# Altium schematic sheet xl6009_kian_v1_MULTY.SchDoc
size A; SheetNumber: 1; SheetTotal: 3
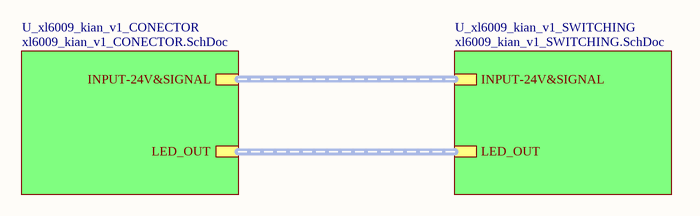
[diagram p0: xl6009_kian_v1_MULTY.SchDoc]

## Sub-sheets
U_xl6009_kian_v1_CONECTOR = xl6009_kian_v1_CONECTOR.SchDoc: LED_OUT (harness LED_OUT), INPUT-24V&SIGNAL (harness INPUT-24V&SIGNAL)
U_xl6009_kian_v1_SWITCHING = xl6009_kian_v1_SWITCHING.SchDoc: INPUT-24V&SIGNAL (harness INPUT-24V&SIGNAL), LED_OUT (harness LED_OUT)

## Buses and harness runs
harness sheet U_xl6009_kian_v1_CONECTOR/INPUT-24V&SIGNAL = sheet U_xl6009_kian_v1_SWITCHING/INPUT-24V&SIGNAL
harness sheet U_xl6009_kian_v1_CONECTOR/LED_OUT = sheet U_xl6009_kian_v1_SWITCHING/LED_OUT